# EAGLE schematic Omniband (EAGLE 9.6.2)
COMPANY: ADAFRUIT INDUSTRIES; DRAWN: KTOWN; REV: F
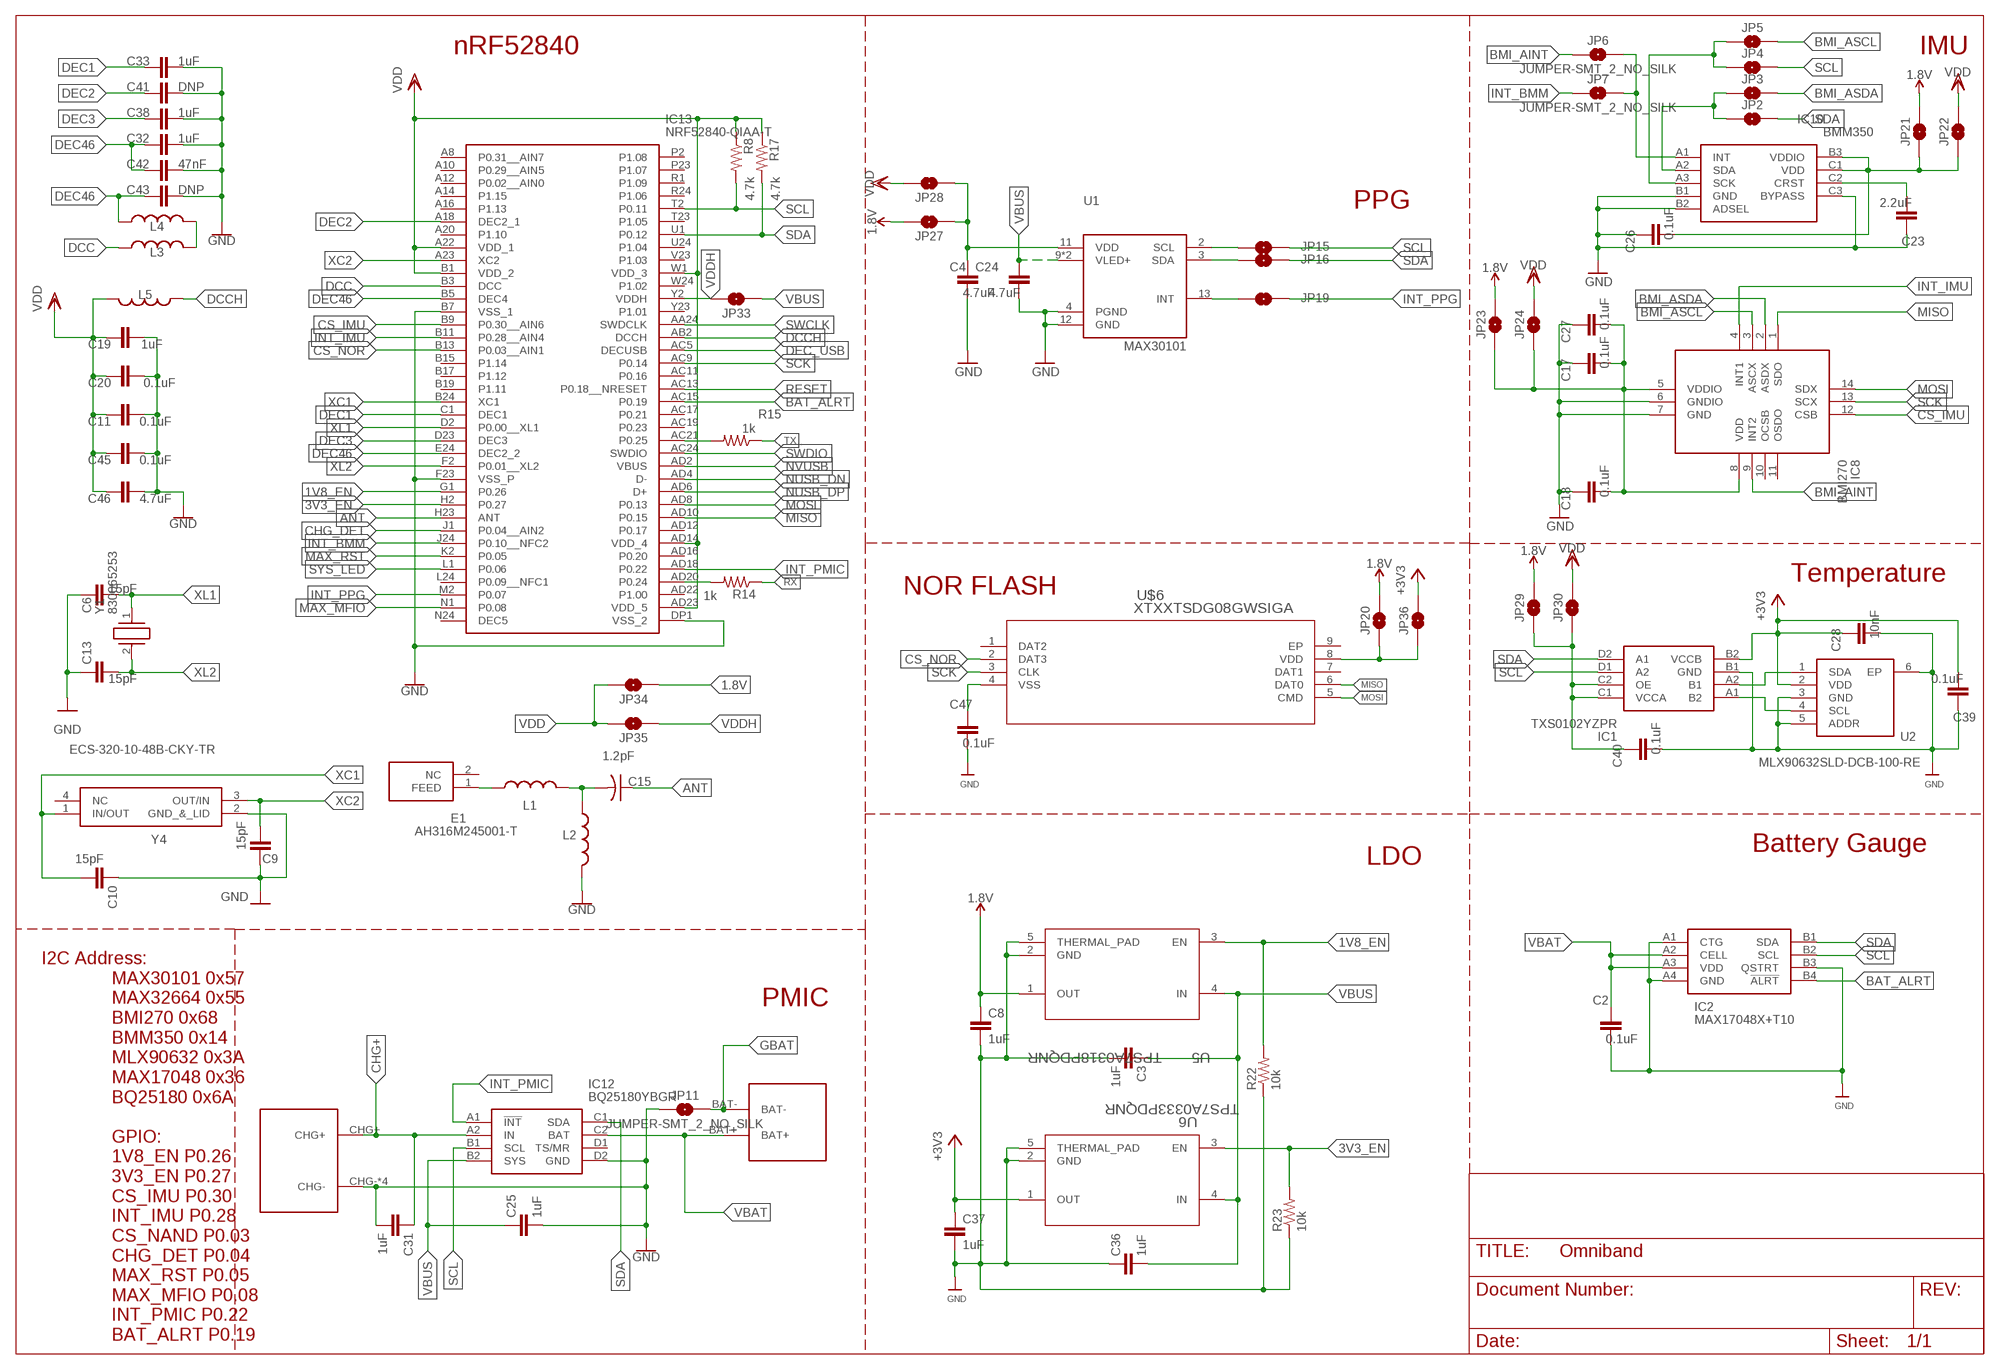
[diagram p0: schematic, sheet 1, part 1 of 2]
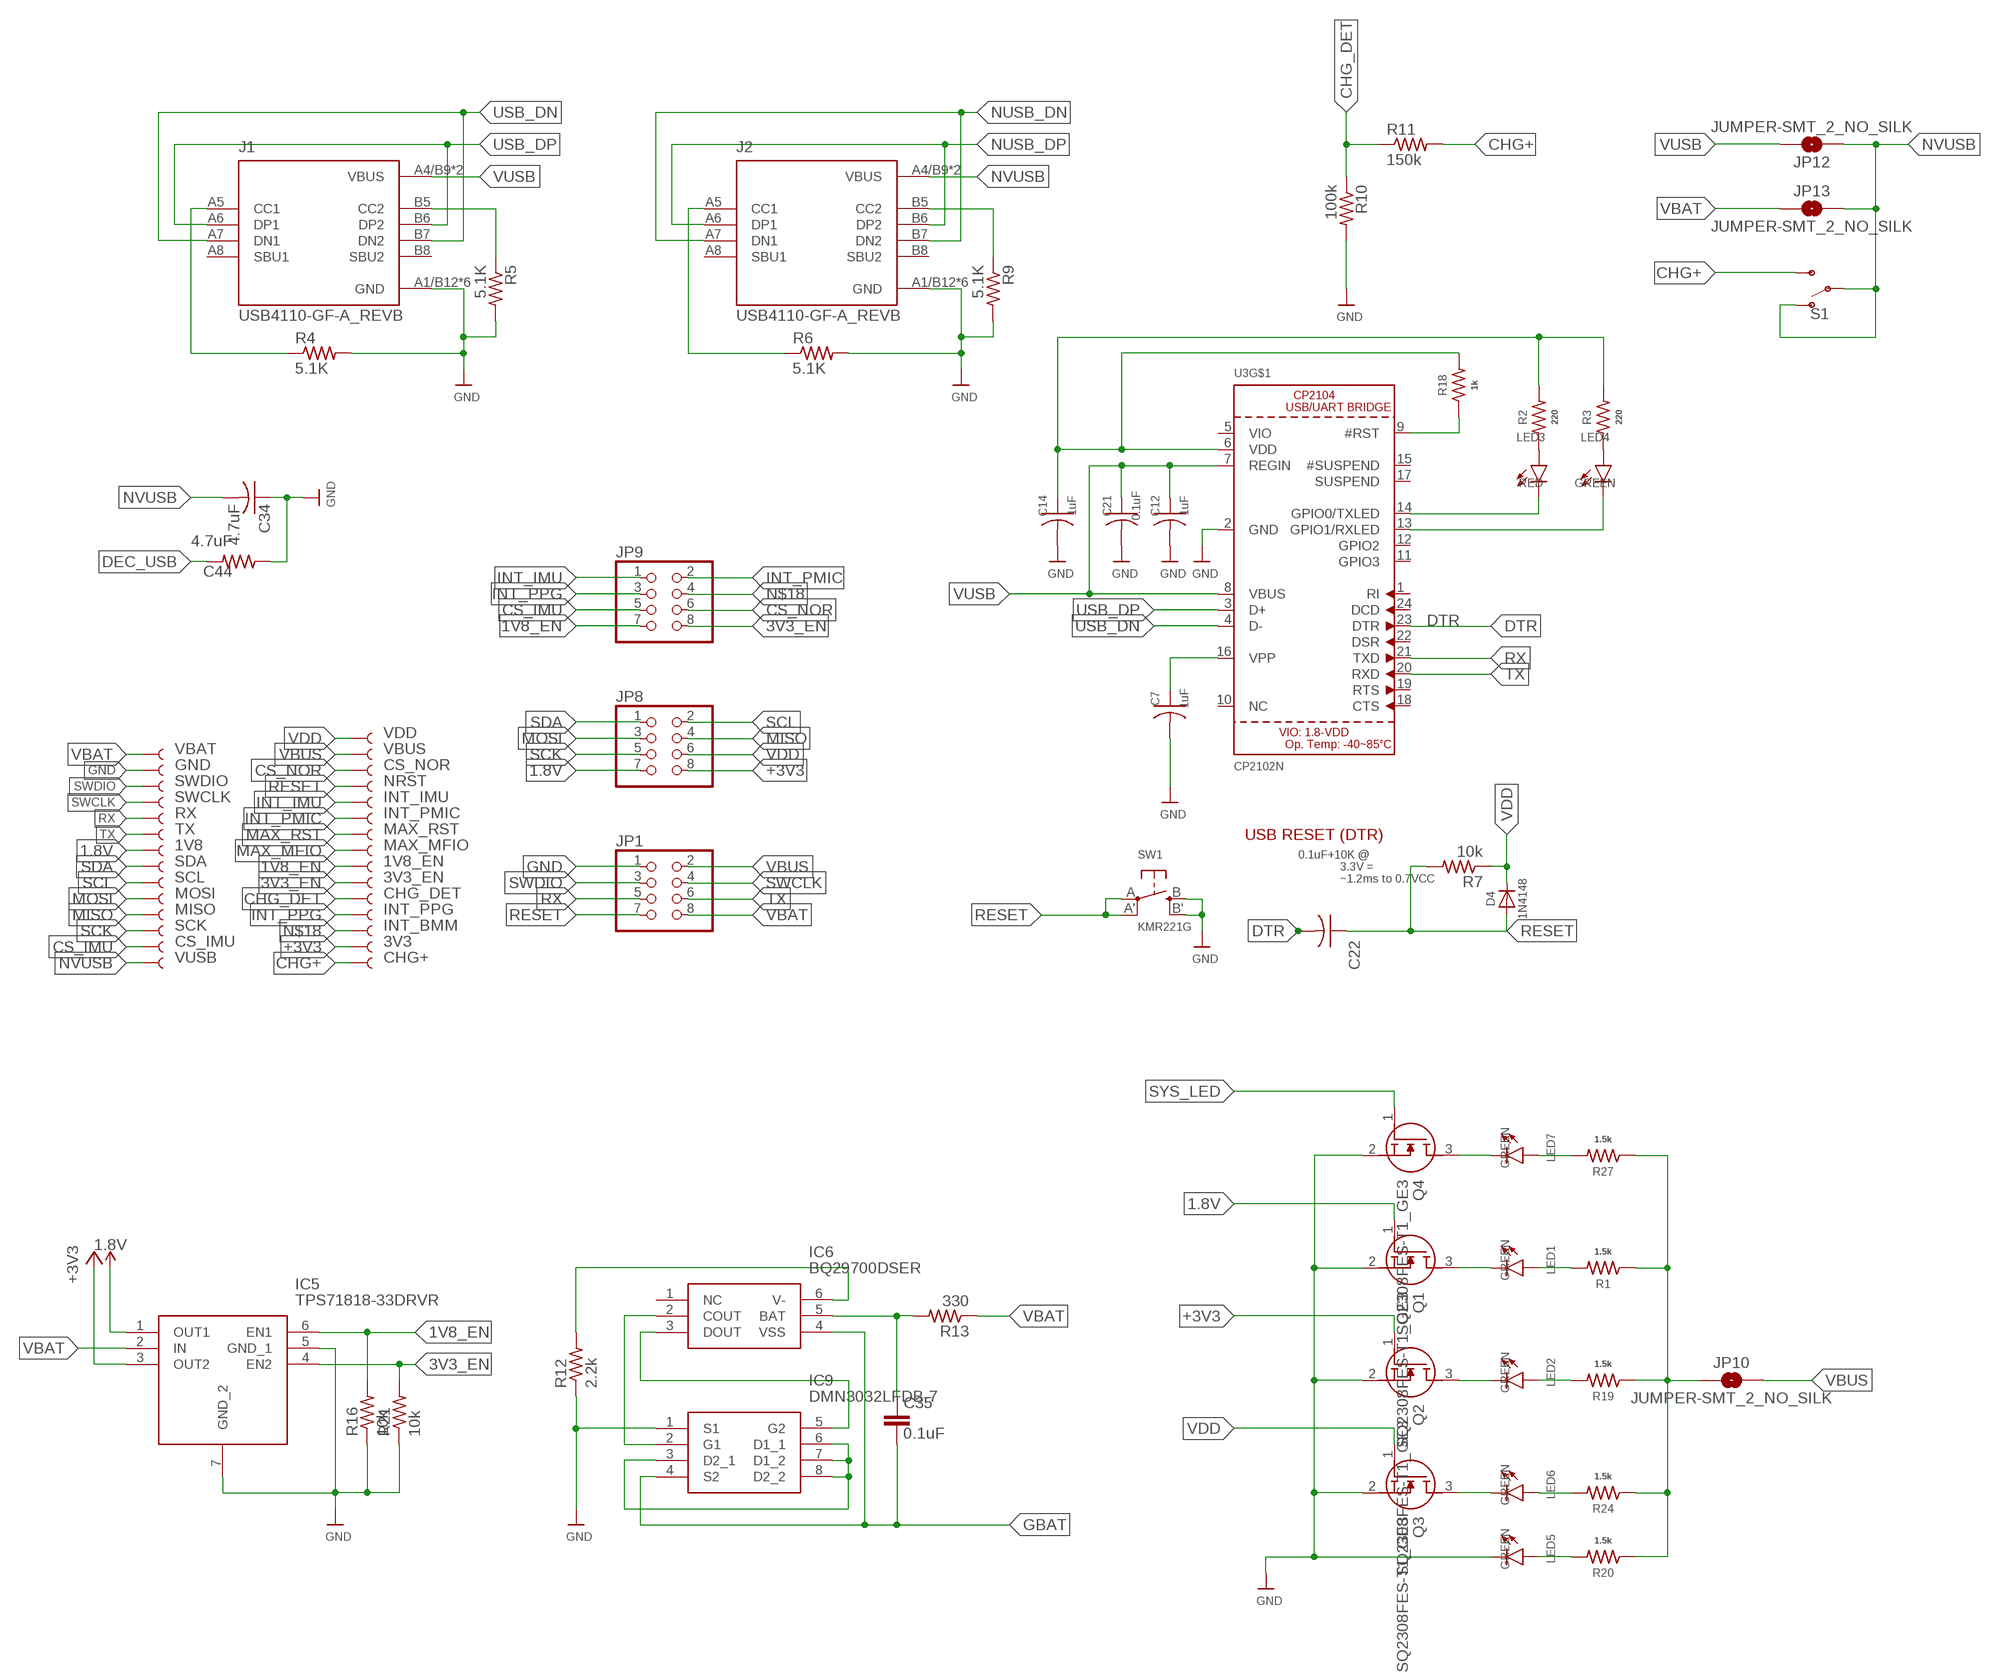
[diagram p1: schematic, sheet 1, part 2 of 2]

## Parts
1V8  TEST-POINT3  [PAD.03X.03]
1V8_EN  TEST-POINT3  [PAD.03X.03]
3V3  TEST-POINT3  [PAD.03X.03]
3V3_EN  TEST-POINT3  [PAD.03X.03]
C2  0.1uF  C-EUC0201  [C0201]
C3  1uF  C-EUC0201  [C0201]
C4  4.7uF  C-EUC0201  [C0201]
C6  15pF  C-EUC0201  [C0201]
C7  1uF  C-USC0603  [C0603]
C8  1uF  C-EUC0201  [C0201]
C9  15pF  C-EUC0201  [C0201]
C10  15pF  C-EUC0201  [C0201]
C11  0.1uF  C-EUC0201  [C0201]
C12  1uF  C-USC0603  [C0603]
C13  15pF  C-EUC0201  [C0201]
C14  1uF  C-USC0603  [C0603]
C15  1.2pF  C-USC0201  [C0201]
C17  0.1uF  C-EUC0201  [C0201]
C18  0.1uF  C-EUC0201  [C0201]
C19  1uF  C-EUC0201  [C0201]
C20  0.1uF  C-EUC0201  [C0201]
C21  0.1uF  C-USC0603  [C0603]
C22  220nF  C-USC0603  [C0603]
C23  2.2uF  C-EUC0201  [C0201]
C24  4.7uF  C-EUC0201  [C0201]
C25  1uF  C-EUC0201  [C0201]
C26  0.1uF  C-EUC0201  [C0201]
C27  0.1uF  C-EUC0201  [C0201]
C28  10nF  C-EUC0201  [C0201]
C31  1uF  C-EUC0201  [C0201]
C32  1uF  C-EUC0201  [C0201]
C33  1uF  C-EUC0201  [C0201]
C34  4.7uF  C-USC0603  [C0603]
C35  0.1uF  C-EUC0201  [C0201]
C36  1uF  C-EUC0201  [C0201]
C37  1uF  C-EUC0201  [C0201]
C38  1uF  C-EUC0201  [C0201]
C39  0.1uF  C-EUC0201  [C0201]
C40  0.1uF  C-EUC0201  [C0201]
C41  DNP  C-EUC0201  [C0201]
C42  47nF  C-EUC0201  [C0201]
C43  DNP  C-EUC0201  [C0201]
C44  4.7uF  R-US_R0201  [R0201]
C45  0.1uF  C-EUC0201  [C0201]
C46  4.7uF  C-EUC0201  [C0201]
C47  0.1uF  C-EUC0201  [C0201]
CHG+  TEST-POINT3  [PAD.03X.03]
CHG_DET  TEST-POINT3  [PAD.03X.03]
CS_IMU  TEST-POINT3  [PAD.03X.03]
CS_NOR  TEST-POINT3  [PAD.03X.03]
D4  1N4148  DIODESOD-323  [SOD-323]
E1  AH316M245001-T  [ANTC3216X60N]
GND  TEST-POINT3  [PAD.03X.03]
IC1  TXS0102YZPR  [BGA8C50P2X4_89X189X50]
IC2  MAX17048X+T10  [BGA8C40P4X2_167X93X69]
IC5  TPS71818-33DRVR  [SON65P200X200X80-7N]
IC6  BQ29700DSER  [SON50P150X150X80-6N]
IC8  BMI270  [BMI270]
IC9  DMN3032LFDB-7  [DMP1046UFDB7]
IC10  BMM350  [BGA9C40P3X3_128X128X54]
IC12  BQ25180YBGR  [BGA8C40P2X4_100X155X50]
IC13  NRF52840-QIAA-T  [NRF52840QIAAT]
INT_BMM  TEST-POINT3  [PAD.03X.03]
INT_IMU  TEST-POINT3  [PAD.03X.03]
INT_PMIC  TEST-POINT3  [PAD.03X.03]
INT_PPG  TEST-POINT3  [PAD.03X.03]
J1  USB4110-GF-A_REVB  [GCT_USB4110-GF-A_REVB]
J2  USB4110-GF-A_REVB  [GCT_USB4110-GF-A_REVB]
JP1  PINHD-2X4  [2X04]
JP2  JUMPER-SMT_2_NO_SILK  [SMT-JUMPER_2_NO_SILK]
JP3  JUMPER-SMT_2_NO_SILK  [SMT-JUMPER_2_NO_SILK]
JP4  JUMPER-SMT_2_NO_SILK  [SMT-JUMPER_2_NO_SILK]
JP5  JUMPER-SMT_2_NO_SILK  [SMT-JUMPER_2_NO_SILK]
JP6  JUMPER-SMT_2_NO_SILK  [SMT-JUMPER_2_NO_SILK]
JP7  JUMPER-SMT_2_NO_SILK  [SMT-JUMPER_2_NO_SILK]
JP8  PINHD-2X4  [2X04]
JP9  PINHD-2X4  [2X04]
JP10  JUMPER-SMT_2_NO_SILK  [SMT-JUMPER_2_NO_SILK]
JP11  JUMPER-SMT_2_NO_SILK  [SMT-JUMPER_2_NO_SILK]
JP12  JUMPER-SMT_2_NO_SILK  [SMT-JUMPER_2_NO_SILK]
JP13  JUMPER-SMT_2_NO_SILK  [SMT-JUMPER_2_NO_SILK]
JP15  JUMPER-SMT_2_NO_SILK  [SMT-JUMPER_2_NO_SILK]
JP16  JUMPER-SMT_2_NO_SILK  [SMT-JUMPER_2_NO_SILK]
JP19  JUMPER-SMT_2_NO_SILK  [SMT-JUMPER_2_NO_SILK]
JP20  JUMPER-SMT_2_NO_SILK  [SMT-JUMPER_2_NO_SILK]
JP21  JUMPER-SMT_2_NO_SILK  [SMT-JUMPER_2_NO_SILK]
JP22  JUMPER-SMT_2_NO_SILK  [SMT-JUMPER_2_NO_SILK]
JP23  JUMPER-SMT_2_NO_SILK  [SMT-JUMPER_2_NO_SILK]
JP24  JUMPER-SMT_2_NO_SILK  [SMT-JUMPER_2_NO_SILK]
JP27  JUMPER-SMT_2_NO_SILK  [SMT-JUMPER_2_NO_SILK]
JP28  JUMPER-SMT_2_NO_SILK  [SMT-JUMPER_2_NO_SILK]
JP29  JUMPER-SMT_2_NO_SILK  [SMT-JUMPER_2_NO_SILK]
JP30  JUMPER-SMT_2_NO_SILK  [SMT-JUMPER_2_NO_SILK]
JP33  JUMPER-SMT_2_NO_SILK  [SMT-JUMPER_2_NO_SILK]
JP34  JUMPER-SMT_2_NO_SILK  [SMT-JUMPER_2_NO_SILK]
JP35  JUMPER-SMT_2_NO_SILK  [SMT-JUMPER_2_NO_SILK]
JP36  JUMPER-SMT_2_NO_SILK  [SMT-JUMPER_2_NO_SILK]
L1  3.3nH  L-USL0201  [L0201]
L2  2.7nH  L-USL0201  [L0201]
L3  10uH  L-USL0201  [L0201]
L4  15nH  L-USL0201  [L0201]
L5  2.7nH  L-USL0201  [L0201]
LED1  GREEN  LEDCHIPLED_0603  [CHIPLED_0603]
LED2  GREEN  LEDCHIPLED_0603  [CHIPLED_0603]
LED3  RED  LEDCHIPLED_0603  [CHIPLED_0603]
LED4  GREEN  LEDCHIPLED_0603  [CHIPLED_0603]
LED5  GREEN  LEDCHIPLED_0603  [CHIPLED_0603]
LED6  GREEN  LEDCHIPLED_0603  [CHIPLED_0603]
LED7  GREEN  LEDCHIPLED_0603  [CHIPLED_0603]
MAX_MFIO  TEST-POINT3  [PAD.03X.03]
MAX_RST  TEST-POINT3  [PAD.03X.03]
MISO  TEST-POINT3  [PAD.03X.03]
MOSI  TEST-POINT3  [PAD.03X.03]
NRST  TEST-POINT3  [PAD.03X.03]
Q1  SQ2308FES-T1_GE3  [SOT95P237X112-3N]
Q2  SQ2308FES-T1_GE3  [SOT95P237X112-3N]
Q3  SQ2308FES-T1_GE3  [SOT95P237X112-3N]
Q4  SQ2308FES-T1_GE3  [SOT95P237X112-3N]
R1  1.5k  R-US_R0603  [R0603]
R2  220  R-US_R0603  [R0603]
R3  220  R-US_R0603  [R0603]
R4  5.1K  R-US_R0603  [R0603]
R5  5.1K  R-US_R0603  [R0603]
R6  5.1K  R-US_R0603  [R0603]
R7  10k  R-US_R0603  [R0603]
R8  4.7k  R-US_R0201  [R0201]
R9  5.1K  R-US_R0603  [R0603]
R10  100k  R-US_R0603  [R0603]
R11  150k  R-US_R0603  [R0603]
R12  2.2k  R-US_R0201  [R0201]
R13  330  R-US_R0201  [R0201]
R14  1k  R-US_R0201  [R0201]
R15  1k  R-US_R0201  [R0201]
R16  10k  R-US_R0201  [R0201]
R17  4.7k  R-US_R0201  [R0201]
R18  1k  R-US_R0603  [R0603]
R19  1.5k  R-US_R0603  [R0603]
R20  1.5k  R-US_R0603  [R0603]
R21  10k  R-US_R0201  [R0201]
R22  10k  R-US_R0201  [R0201]
R23  10k  R-US_R0201  [R0201]
R24  1.5k  R-US_R0603  [R0603]
R27  1.5k  R-US_R0603  [R0603]
RX  TEST-POINT3  [PAD.03X.03]
S1  SWITCH-SPDT-SMD-RIGHT-ANGLE  [SWITCH_SPST_SMD_A]
SCK  TEST-POINT3  [PAD.03X.03]
SCL  TEST-POINT3  [PAD.03X.03]
SDA  TEST-POINT3  [PAD.03X.03]
SW1  KMR221G  SWITCH_TACT_SMT4.6X2.8  [BTN_KMR2_4.6X2.8]
SWCLK  TEST-POINT3  [PAD.03X.03]
SWDIO  TEST-POINT3  [PAD.03X.03]
TX  TEST-POINT3  [PAD.03X.03]
U1  MAX30101  AS-ITM-00473  [MAX30100]
U2  MLX90632SLD-DCB-100-RE  [MLX90632SLDDCB100RE]
U3  CP2102N  CP2104  [QFN24_4MM_SMSC]
U5  TPS7A0318PDQNR  [DQN0004A-MFG]
U6  TPS7A0333PDQNR  [DQN0004A-MFG]
U$3  GRP160722  [GRP160722]
U$6  XTXXTSDG08GWSIGA  [WNG008_SPA]
U$8  CX-4MM-JZ  [CX-4MM-JZ]
VBAT  TEST-POINT3  [PAD.03X.03]
VBUS  TEST-POINT3  [PAD.03X.03]
VDD  TEST-POINT3  [PAD.03X.03]
VUSB  TEST-POINT3  [PAD.03X.03]
Y1  830065253  [830065253]
Y4  ECS-320-10-48B-CKY-TR  [ECS3201048BCKYTR]

## Nets
1.8V [POWER]: 1V8.P$1 C8.1 IC5.1(OUT1) JP8.7 JP20.2 JP21.2 JP23.2 JP27.2 JP29.2 JP34.1 Q1.1(G) U5.1(OUT)
1V8_EN: 1V8_EN.P$1 IC5.6(EN1) IC13.G1(P0.26) JP9.7 R16.2 R22.2 U5.3(EN)
3V3_EN: 3V3_EN.P$1 IC5.4(EN2) IC13.H2(P0.27) JP9.8 R21.2 R23.2 U6.3(EN)
+3V3: 3V3.P$1 C28.1 C37.1 C39.2 IC1.B2(VCCB) IC5.3(OUT2) JP8.8 JP36.2 Q2.1(G) U2.2(VDD) U6.1(OUT)
ANT: C15.1 IC13.H23(ANT)
BAT_ALRT: IC2.B4(!ALRT) IC13.AC15(P0.19)
BMI_AINT: IC8.9(INT2) JP6.1
BMI_ASCL: IC8.3(ASCX) JP5.2
BMI_ASDA: IC8.2(ASDX) JP3.2
CHG+: C31.1 CHG+.P$1 IC12.A2(IN) R11.2 S1.3(S) U$8.CHG+
CHG_DET: CHG_DET.P$1 IC13.J1(P0.04__AIN2) R10.1 R11.1
CS_IMU: CS_IMU.P$1 IC8.12(CSB) IC13.B9(P0.30__AIN6) JP9.5
CS_NOR: CS_NOR.P$1 IC13.B13(P0.03__AIN1) JP9.6 U$6.2(DAT3)
DCC: IC13.B3(DCC) L3.1
DCCH: IC13.AB2(DCCH) L5.1
DEC1: C33.2 IC13.C1(DEC1)
DEC2: C41.2 IC13.A18(DEC2_1)
DEC3: C38.2 IC13.D23(DEC3)
DEC46: C32.2 C42.2 C43.2 IC13.B5(DEC4) IC13.E24(DEC2_2) L4.1
DEC_USB: C44.2 IC13.AC5(DECUSB)
DTR: C22.2 U3.23(DTR)
GBAT: C35.2 IC6.4(VSS) IC9.4(S2) JP11.2 U$3.BAT-
GND: C2.2 C3.2 C4.2 C6.1 C7.2 C8.2 C9.1 C10.1 C11.1 C12.2 C13.1 C14.2 C17.1 C18.1 C19.2 C20.2 C21.2 C23.1 C24.2 C25.2 C26.1 C27.1 C28.2 C31.2 C32.1 C33.1 C34.1 C36.1 C37.2 C38.1 C39.1 C40.2 C41.1 C42.1 C43.1 C44.1 C45.1 C46.1 C47.2 GND.P$1 IC1.B1(GND) IC2.A1(CTG) IC2.A4(GND) IC2.B3(QSTRT) IC5.5(GND_1) IC5.7(GND_2) IC8.6(GNDIO) IC8.7(GND) IC9.1(S1) IC10.B1(GND) IC10.B2(ADSEL) IC10.C3(BYPASS) IC12.D2(GND) IC13.B7(VSS_1) IC13.DP1(VSS_2) IC13.F23(VSS_P) J1.A1/B12(GND) J1.B1/A12(GND) J1.S1(GND) J1.S2(GND) J1.S3(GND) J1.S4(GND) J2.A1/B12(GND) J2.B1/A12(GND) J2.S1(GND) J2.S2(GND) J2.S3(GND) J2.S4(GND) JP1.1 JP11.1 L2.2 LED5.C Q1.2(S) Q2.2(S) Q3.2(S) Q4.2(S) R4.2 R5.2 R6.2 R9.2 R10.2 R12.1 R16.1 R21.1 R22.1 R23.1 SW1.B'(S1) SW1.B(S) U1.4(PGND) U1.12(GND) U2.3(GND) U2.5(ADDR) U2.6(EP) U3.2(GND) U5.2(GND) U5.5(THERMAL_PAD) U6.2(GND) U6.5(THERMAL_PAD) U$8.CHG- U$8.CHG-1(CHG-) U$8.CHG-2(CHG-) U$8.CHG-3(CHG-) Y4.2(GND_&_LID)
INT_BMM: IC13.J24(P0.10__NFC2) JP7.1
INT_IMU: IC8.4(INT1) IC13.B11(P0.28__AIN4) INT_IMU.P$1 JP9.1
INT_PMIC: IC12.A1(!INT) IC13.AD18(P0.22) INT_PMIC.P$1 JP9.2
INT_PPG: IC13.M2(P0.07) INT_PPG.P$1 JP9.3 JP19.2
MAX_MFIO: IC13.N1(P0.08) MAX_MFIO.P$1
MAX_RST: IC13.K2(P0.05) MAX_RST.P$1
MISO: IC8.1(SDO) IC13.AD10(P0.15) JP8.4 MISO.P$1 U$6.6(DAT0)
MOSI: IC8.14(SDX) IC13.AD8(P0.13) JP8.3 MOSI.P$1 U$6.5(CMD)
N$1: L3.2 L4.2
N$2: C47.1 U$6.4(VSS)
N$3: JP15.1 U1.2(SCL)
N$4: C15.2 L1.2 L2.1
N$5: IC10.A2(SDA) JP2.1 JP3.1
N$8: E1.1(FEED) L1.1
N$9: IC10.A3(SCK) JP4.1 JP5.1
N$10: IC6.2(COUT) IC9.2(G1)
N$11: J1.B5(CC2) R5.1
N$12: IC13.AC21(P0.25) R15.2
N$13: IC13.AD20(P0.24) R14.2
N$14: C23.2 IC10.C2(CRST)
N$15: C7.1 U3.16(VPP)
N$17: JP10.1 R1.1 R19.1 R20.1 R24.1 R27.1
N$18: IC10.A1(INT) INT_BMM.P$1 JP6.2 JP7.2 JP9.4
N$19: LED6.C Q3.3(D)
N$21: LED3.A R2.1
N$22: LED4.A R3.1
N$23: LED3.C U3.14(GPIO0/TXLED)
N$24: LED4.C U3.13(GPIO1/RXLED)
N$25: J1.A5(CC1) R4.1
N$26: J2.B5(CC2) R9.1
N$27: J2.A5(CC1) R6.1
N$28: IC6.3(DOUT) IC9.5(G2)
N$29: IC9.3(D2_1) IC9.6(D1_1) IC9.7(D1_2) IC9.8(D2_2)
N$30: R18.1 U3.9(#RST)
N$31: IC6.6(V-) R12.2
N$32: C35.1 IC6.5(BAT) R13.2
N$33: LED2.A R19.2
N$34: LED6.A R24.2
N$35 [POWER]: C40.1 IC1.C1(VCCA) IC1.C2(OE) JP29.1 JP30.1
N$36: IC1.A2(B1) U2.1(SDA)
N$37: IC1.A1(B2) U2.4(SCL)
N$38: C14.1 R2.2 R3.2 R18.2 U3.6(VDD)
N$39: LED5.A R20.2
N$40: LED1.A R1.2
N$41: LED1.C Q1.3(D)
N$42: LED2.C Q2.3(D)
N$43: JP16.1 U1.3(SDA)
N$44: JP19.1 U1.13(INT)
N$48 [POWER]: C17.2 C18.2 C27.2 IC8.5(VDDIO) IC8.8(VDD) JP23.1 JP24.1
N$50 [POWER]: C26.2 IC10.B3(VDDIO) IC10.C1(VDD) JP21.1 JP22.1
N$51 [POWER]: C4.1 JP27.1 JP28.1 U1.11(VDD)
N$53: JP20.1 JP36.1 U$6.8(VDD)
N$54: LED7.C Q4.3(D)
N$55: LED7.A R27.2
NUSB_DN: IC13.AD4(D-) J2.A7(DN1) J2.B7(DN2)
NUSB_DP: IC13.AD6(D+) J2.A6(DP1) J2.B6(DP2)
NVUSB: C34.2 IC13.AD2(VBUS) J2.A4/B9(VBUS) J2.B4/A9(VBUS) JP12.1 JP13.2 S1.1(O) S1.2(P) VUSB.P$1
RESET: C22.1 D4.A IC13.AC13(P0.18__NRESET) JP1.7 NRST.P$1 R7.2 SW1.A'(P1) SW1.A(P)
RX: JP1.5 R14.1 RX.P$1 U3.21(TXD)
SCK: IC8.13(SCX) IC13.AC9(P0.14) JP8.5 SCK.P$1 U$6.3(CLK)
SCL: IC1.D1(A2) IC2.B2(SCL) IC12.B1(SCL) IC13.T2(P0.11) JP4.2 JP8.2 JP15.2 R8.2 SCL.P$1
SDA: IC1.D2(A1) IC2.B1(SDA) IC12.C1(SDA) IC13.U1(P0.12) JP2.2 JP8.1 JP16.2 R17.2 SDA.P$1
SWCLK: IC13.AA24(SWDCLK) JP1.4 SWCLK.P$1
SWDIO: IC13.AC24(SWDIO) JP1.3 SWDIO.P$1
SYS_LED: IC13.L1(P0.06) Q4.1(G)
TX: JP1.6 R15.1 TX.P$1 U3.20(RXD)
USB_DN: J1.A7(DN1) J1.B7(DN2) U3.4(D-)
USB_DP: J1.A6(DP1) J1.B6(DP2) U3.3(D+)
VBAT [POWER]: C2.1 IC2.A2(CELL) IC2.A3(VDD) IC5.2(IN) IC12.C2(BAT) JP1.8 JP13.1 R13.1 U$3.BAT+ VBAT.P$1
VBUS [POWER]: C3.1 C24.1 C25.1 C36.2 IC12.B2(SYS) JP1.2 JP10.2 JP33.1 U1.9(VLED+) U1.10(VLED+) U5.4(IN) U6.4(IN) VBUS.P$1
VDD [POWER]: C11.2 C19.1 C20.1 C45.2 C46.2 D4.C IC13.A22(VDD_1) IC13.AD14(VDD_4) IC13.AD23(VDD_5) IC13.B1(VDD_2) IC13.W1(VDD_3) JP8.6 JP22.2 JP24.2 JP28.2 JP30.2 JP34.2 JP35.2 L5.2 Q3.1(G) R7.1 R8.1 R17.1 VDD.P$1
VDDH: IC13.Y2(VDDH) JP33.2 JP35.1
VUSB: C12.1 C21.1 J1.A4/B9(VBUS) J1.B4/A9(VBUS) JP12.2 U3.7(REGIN) U3.8(VBUS)
XC1: C10.2 IC13.B24(XC1) Y4.1(IN/OUT)
XC2: C9.2 IC13.A23(XC2) Y4.3(OUT/IN)
XL1: C6.2 IC13.D2(P0.00__XL1) Y1.1(CRYSTAL_1)
XL2: C13.2 IC13.F2(P0.01__XL2) Y1.2(CRYSTAL_2)
Unconnected: E1.2(NC) IC6.1(NC) IC8.10(OCSB) IC8.11(OSDO) IC12.D1(TS/MR) IC13.A8(P0.31__AIN7) IC13.A10(P0.29__AIN5) IC13.A12(P0.02__AIN0) IC13.A14(P1.15) IC13.A16(P1.13) IC13.A20(P1.10) IC13.AC11(P0.16) IC13.AC17(P0.21) IC13.AC19(P0.23) IC13.AD12(P0.17) IC13.AD16(P0.20) IC13.AD22(P1.00) IC13.B15(P1.14) IC13.B17(P1.12) IC13.B19(P1.11) IC13.L24(P0.09__NFC1) IC13.N24(DEC5) IC13.P2(P1.08) IC13.P23(P1.07) IC13.R1(P1.09) IC13.R24(P1.06) IC13.T23(P1.05) IC13.U24(P1.04) IC13.V23(P1.03) IC13.W24(P1.02) IC13.Y23(P1.01) J1.A8(SBU1) J1.B8(SBU2) J2.A8(SBU1) J2.B8(SBU2) U3.1(RI) U3.10(NC) U3.11(GPIO3) U3.12(GPIO2) U3.15(#SUSPEND) U3.17(SUSPEND) U3.18(CTS) U3.19(RTS) U3.22(DSR) U3.24(DCD) U$6.1(DAT2) U$6.7(DAT1) U$6.9(EP) Y4.4(NC)

## Notes on the sheet
- nRF52840 | IMU
- PPG
- Temperature
- NOR FLASH
- USB RESET (DTR)
- 0.1uF+10K @
                3.3V =
                ~1.2ms to 0.7VCC
- Battery Gauge
- LDO
- PMIC
- I2C Address:
                MAX30101 0x57
                MAX32664 0x55
                BMI270 0x68
                BMM350 0x14
                MLX90632 0x3A
                MAX17048 0x36
                BQ25180 0x6A
  
                GPIO:
                1V8_EN P0.26
                3V3_EN P0.27
                CS_IMU P0.30
                INT_IMU P0.28
                CS_NAND P0.03
                CHG_DET P0.04
                MAX_RST P0.05
                MAX_MFIO P0.08
                INT_PMIC P0.22
                BAT_ALRT P0.19

## Power pins joined to a net without a drawn wire
TP: U3.THERM(TP)
VIO: U3.5(VIO)

## Library data of the parts
1V8 1V8_EN 3V3 3V3_EN CHG+ CHG_DET CS_IMU CS_NOR GND INT_BMM INT_IMU INT_PMIC INT_PPG MAX_MFIO MAX_RST MISO MOSI NRST RX SCK SCL SDA SWCLK SWDIO TX VBAT VBUS VDD VUSB = SparkFun-Connectors:TEST-POINT: SparkFun Test Points Bare copper test points for troubleshooting or In-Circuit-Testing. These are used by our Production team for verifying production board runs using pogo-pins on test beds. SparkFun Products: SparkFun LSM9DS1 Breakout <https://www.sparkfun.com/products/13284> SparkFun PSOC <https://www.sparkfun.com/products/13714> SparkFun Load Cell Amplifier <https://www.sparkfun.com/products/13879>
C2-C4 C6 C8-C11 C13 C17-C20 C23-C28 C31-C33 C35-C43 C45-C47 = rcl:C-EU: CAPACITOR, European symbol; SPICEPREFIX: C
C7 C12 C14 C15 C21 C22 C34 = rcl:C-US: CAPACITOR, American symbol; SPICEPREFIX: C
C44 R1-R24 R27 = rcl:R-US_: RESISTOR, American symbol; SPICEPREFIX: R
D4 = microbuilder:DIODE: Diode SMA Model Volts Amps Type Vf Ir Digikey # Notes SSA34-E3 40V 3A Schottky 480mV @ 3A 200uA @ 40V SSA34-E3/61TGITR-ND CDBA120-G 20V 1A Schottky 500mV @ 1A 500uA @ 20V 641-1014-6-ND REEL MBRA210 10V 2A Schottky 350mV @ 2A 700uA @ 10V MBRA210LT3 SOD-123 Model Volts Amps Type Vf Ir Order # Notes BAT54T1G 30V 200mA Schottky 800mV @ 200mA 2uA @ 25V BAT54T1GOSTR-ND B0530W 30V 500mA Schottky 430mV @ 500mA 130uA @ 30V B0530W-FDICT-ND REEL MBR120 20V 1A Schottky 340mV @ 1A MBR120VLSFT1GOSCT-ND SOD-323 Model Volts Amps Type Vf Ir Order # Notes PMEG2005EJ 20V 500mA Schottky 355mV @ 500mA 568-4110-1-ND ZLLS410 10V 570mA Schottky 380mV @ 570mA ZLLS410CT-ND 1N4148WS 75V 150mA Silicon/Simple 1V 1N4148WSFSCT-ND REEL SOD-523 Model Volts Amps Type Vf Ir Order # Notes BAT54XV2 30V 200mA Schottky 0.8V @ 100mA BAT54XV2CT-ND TB751S 30V 30mA Schottky RB751S-40TE61CT-ND SOT23-R/W (R = Solder Paste/Reflow Ovens, W = Hand-Soldering) Model Volts Amps Type Vf Ir Order # Notes BAT54FILM 40V 300mA Schottky 497-7162-1-ND POWERDI-5 Model Volts Amps Type Vf Ir Order # Notes PDS560 60V 5A Schottky 670mV @ 5A 150uA @ 60V PDS560DICT-ND
E1 = SamacSys_Parts:AH316M245001-T: Antennas SURF MOUNT ANTENNA RADIEDGE Source: Datasheet; DESCRIPTION: Antennas SURF MOUNT ANTENNA RADIEDGE; HEIGHT: 0.6mm; MANUFACTURER_NAME: TAIYO YUDEN; MANUFACTURER_PART_NUMBER: AH316M245001-T; MOUSER_PART_NUMBER: 963-AH316M245001-T; MOUSER_PRICE-STOCK: https://www.mouser.co.uk/ProductDetail/TAIYO-YUDEN/AH316M245001-T?qs=I6KAKw0tg2zXv3bNBw9dFQ%3D%3D
IC1 = TXS0102YZPR:TXS0102YZPR: 2-Bit Bidirectional Voltage-Level Shifter for Open-Drain and Push-Pull Application Source: Datasheet <http://componentsearchengine.com/Datasheets/3/TXS0102YZPR.pdf>; DESCRIPTION: 2-Bit Bidirectional Voltage-Level Shifter for Open-Drain and Push-Pull Application; HEIGHT: 0.5mm; MANUFACTURER_NAME: Texas Instruments; MANUFACTURER_PART_NUMBER: TXS0102YZPR; MOUSER_PART_NUMBER: 595-TXS0102YZPR; MOUSER_PRICE-STOCK: https://www.mouser.co.uk/ProductDetail/Texas-Instruments/TXS0102YZPR?qs=0OHPnBYoB%2FnEzbbqlIZg1Q%3D%3D
IC2 = SamacSys_Parts:MAX17048X+T10: Battery Battery Monitor IC Lithium Ion 8-WLP (1.66x0.92) Source: Datasheet <https://pdfserv.maximintegrated.com/package_dwgs/21-0555.PDF>; DESCRIPTION: Battery Battery Monitor IC Lithium Ion 8-WLP (1.66x0.92); HEIGHT: 0.69mm; MANUFACTURER_NAME: Analog Devices; MANUFACTURER_PART_NUMBER: MAX17048X+T10; MOUSER_PART_NUMBER: 700-MAX17048X+T10; MOUSER_PRICE-STOCK: https://www.mouser.co.uk/ProductDetail/Analog-Devices-Maxim-Integrated/MAX17048X%2bT10?qs=skSDD0nPMtl2jmkDAM2OXw%3D%3D
IC5 = SamacSys_Parts:TPS71818-33DRVR: Dual 200mA Output, Low Noise, High PSRR, Low Dropout, Linear Regulator Source: Datasheet <http://www.ti.com/lit/gpn/TPS718>; ARROW_PART_NUMBER: TPS71818-33DRVR; ARROW_PRICE-STOCK: https://www.arrow.com/en/products/tps71818-33drvr/texas-instruments; DESCRIPTION: Dual 200mA Output, Low Noise, High PSRR, Low Dropout, Linear Regulator; HEIGHT: 0.8mm; MANUFACTURER_NAME: Texas Instruments; MANUFACTURER_PART_NUMBER: TPS71818-33DRVR
IC6 = SamacSys_Parts:BQ29700DSER: Li-Ion/Li Polymer Advanced Single-Cell Battery Protector IC Family Source: Datasheet <http://www.ti.com/lit/ds/symlink/bq2971.pdf>; DESCRIPTION: Li-Ion/Li Polymer Advanced Single-Cell Battery Protector IC Family; HEIGHT: 0.8mm; MANUFACTURER_NAME: Texas Instruments; MANUFACTURER_PART_NUMBER: BQ29700DSER; MOUSER_PART_NUMBER: 595-BQ29700DSER; MOUSER_PRICE-STOCK: https://www.mouser.co.uk/ProductDetail/Texas-Instruments/BQ29700DSER?qs=%2Fd%252BFzHvH4c3zNh7Hkm%2Fvbw%3D%3D
IC8 = SamacSys_Parts:BMI270: IMUs - Inertial Measurement Units Smart Ultra-Low Power Inertial Measurement Unit (IMU) for Wearable Applications Source: Datasheet <https://www.bosch-sensortec.com/media/boschsensortec/downloads/datasheets/bst-bmi270-ds000.pdf>; DESCRIPTION: IMUs - Inertial Measurement Units Smart Ultra-Low Power Inertial Measurement Unit (IMU) for Wearable Applications; HEIGHT: 0.87mm; MANUFACTURER_NAME: BOSCH; MANUFACTURER_PART_NUMBER: BMI270; MOUSER_PART_NUMBER: 262-BMI270; MOUSER_PRICE-STOCK: https://www.mouser.co.uk/ProductDetail/Bosch-Sensortec/BMI270?qs=u16ybLDytRYIj%252BjQEee88A%3D%3D
IC9 = SamacSys_Parts:DMN3032LFDB-7: MOSFET MOSFET BVDSS Source: Datasheet <https://www.diodes.com/assets/Datasheets/DMN3032LFDB.pdf>; DESCRIPTION: MOSFET MOSFET BVDSS; HEIGHT: 0.605mm; MANUFACTURER_NAME: Diodes Incorporated; MANUFACTURER_PART_NUMBER: DMN3032LFDB-7; MOUSER_PART_NUMBER: 621-DMN3032LFDB-7; MOUSER_PRICE-STOCK: https://www.mouser.co.uk/ProductDetail/Diodes-Incorporated/DMN3032LFDB-7?qs=60RJRzIpcl%2FACqnWGZWGig%3D%3D
IC10 = SamacSys_Parts:BMM350: Board Mount Hall Effect / Magnetic Sensors High-Performance Magnometer Source: Datasheet <https://www.bosch-sensortec.com/media/boschsensortec/downloads/datasheets/bst-bmm350-ds001.pdf>; DESCRIPTION: Board Mount Hall Effect / Magnetic Sensors High-Performance Magnometer; HEIGHT: 0.54mm; MANUFACTURER_NAME: BOSCH; MANUFACTURER_PART_NUMBER: BMM350; MOUSER_PART_NUMBER: 262-BMM350; MOUSER_PRICE-STOCK: https://www.mouser.co.uk/ProductDetail/Bosch-Sensortec/BMM350?qs=amGC7iS6iy9v98dnmxozLQ%3D%3D
IC12 = BQ25180YBGR:BQ25180YBGR: Charger IC Lithium Ion/Polymer, Lithium Iron Phosphate 8-DSBGA (1.6x1.1) Source: Datasheet <https://www.ti.com/lit/ds/symlink/bq25180.pdf?ts=1650264094470&ref_url=https%3A%2F%2Fwww.ti.com%2Fproduct%2FBQ25180>; DESCRIPTION: Charger IC Lithium Ion/Polymer, Lithium Iron Phosphate 8-DSBGA (1.6x1.1); HEIGHT: 0.5mm; MANUFACTURER_NAME: Texas Instruments; MANUFACTURER_PART_NUMBER: BQ25180YBGR; MOUSER_PART_NUMBER: 595-BQ25180YBGR; MOUSER_PRICE-STOCK: https://www.mouser.co.uk/ProductDetail/Texas-Instruments/BQ25180YBGR?qs=doiCPypUmgEWjAK%252BJAX6Tw%3D%3D
IC13 = nRF52840-QIAA-T:NRF52840-QIAA-T: RF System on a Chip - SoC BLE ANT 2.4GHz SOC Source: Datasheet; DESCRIPTION: RF System on a Chip - SoC BLE ANT 2.4GHz SOC; HEIGHT: 0.85mm; MANUFACTURER_NAME: Nordic Semiconductor; MANUFACTURER_PART_NUMBER: nRF52840-QIAA-T; MOUSER_PART_NUMBER: 949-NRF52840-QIAA-T; MOUSER_PRICE-STOCK: https://www.mouser.co.uk/ProductDetail/Nordic-Semiconductor/nRF52840-QIAA-T?qs=AQlKX63v8RtTyx08F8csPQ%3D%3D
J1 J2 = USB4110-GF-A_REVB:USB4110-GF-A_REVB: Check availability <https://pricing.snapeda.com/parts/USB4110-GF-A/GCT/view-part?ref=eda>; AVAILABILITY: In Stock; DESCRIPTION: USB-C (USB TYPE-C) USB 2.0 Receptacle Connector 24 (16+8 Dummy) Position Surface Mount, Right Angle; Through Hole; MF: GCT; MP: USB4110-GF-A; PACKAGE: None; PRICE: None; PURCHASE-URL: https://pricing.snapeda.com/search/part/USB4110-GF-A/?ref=eda
JP1 JP8 JP9 = pinhead:PINHD-2X4: PIN HEADER
JP2-JP7 JP10-JP13 JP15 JP16 JP19-JP24 JP27-JP30 JP33-JP36 = SparkFun-Jumpers:JUMPER-SMT_2_NO: Normally open jumper This jumper has two pads in close proximity to each other. Apply solder to close the connection. Round pads are easier to solder for beginners, but are a lot larger. SparkFun Product that uses the round pads: SparkFun EL Sequencer <https://www.sparkfun.com/products/12781>
L1-L5 = rcl:L-US: INDUCTOR, American symbol; SPICEPREFIX: L
LED1-LED7 = led:LED: LED OSRAM: - CHIPLED LG R971, LG N971, LY N971, LG Q971, LY Q971, LO R971, LY R971 LH N974, LH R974 LS Q976, LO Q976, LY Q976 LO Q996 - Hyper CHIPLED LW Q18S LB Q993, LB Q99A, LB R99A - SideLED LS A670, LO A670, LY A670, LG A670, LP A670 LB A673, LV A673, LT A673, LW A673 LH A674 LY A675 LS A676, LA A676, LO A676, LY A676, LW A676 LS A679, LY A679, LG A679 - Hyper Micro SIDELED® LS Y876, LA Y876, LO Y876, LY Y876 LT Y87S - SmartLED LW L88C, LW L88S LB L89C, LB L89S, LG L890 LS L89K, LO L89K, LY L89K LS L896, LA L896, LO L896, LY L896 - TOPLED LS T670, LO T670, LY T670, LG T670, LP T670 LSG T670, LSP T670, LSY T670, LOP T670, LYG T670 LG T671, LOG T671, LSG T671 LB T673, LV T673, LT T673, LW T673 LH T674 LS T676, LA T676, LO T676, LY T676, LB T676, LH T676, LSB T676, LW T676 LB T67C, LV T67C, LT T67C, LS T67K, LO T67K, LY T67K, LW E67C LS E67B, LA E67B, LO E67B, LY E67B, LB E67C, LV E67C, LT E67C LW T67C LS T679, LY T679, LG T679 LS T770, LO T770, LY T770, LG T770, LP T770 LB T773, LV T773, LT T773, LW T773 LH T774 LS E675, LA E675, LY E675, LS T675 LS T776, LA T776, LO T776, LY T776, LB T776 LHGB T686 LT T68C, LB T68C - Hyper Mini TOPLED® LB M676 - Mini TOPLED Santana® LG M470 LS M47K, LO M47K, LY M47K Source: http://www.osram.convergy.de LUXEON: - LUMILED® LXK2-PW12-R00, LXK2-PW12-S00, LXK2-PW14-U00, LXK2-PW14-V00 LXK2-PM12-R00, LXK2-PM12-S00, LXK2-PM14-U00 LXK2-PE12-Q00, LXK2-PE12-R00, LXK2-PE12-S00, LXK2-PE14-T00, LXK2-PE14-U00 LXK2-PB12-K00, LXK2-PB12-L00, LXK2-PB12-M00, LXK2-PB14-N00, LXK2-PB14-P00, LXK2-PB14-Q00 LXK2-PR12-L00, LXK2-PR12-M00, LXK2-PR14-Q00, LXK2-PR14-R00 LXK2-PD12-Q00, LXK2-PD12-R00, LXK2-PD12-S00 LXK2-PH12-R00, LXK2-PH12-S00 LXK2-PL12-P00, LXK2-PL12-Q00, LXK2-PL12-R00 Source: www.luxeon.com KINGBRIGHT: KA-3528ASYC Source: www.kingbright.com
Q1-Q4 = SQ2308FES-T1_GE3:SQ2308FES-T1_GE3: TrenchFET Power MOSFET AEC-Q101 Qualified 100 % Rg and UIS Tested Material categorization: for definitions of compliance please see www.vishay.com/doc?99912 Source: Datasheet <https://www.vishay.com/docs/62166/sq2308fes.pdf>; DESCRIPTION: TrenchFET Power MOSFET AEC-Q101 Qualified 100 % Rg and UIS Tested Material categorization: for definitions of compliance please see www.vishay.com/doc?99912; HEIGHT: 1.12mm; MANUFACTURER_NAME: Vishay; MANUFACTURER_PART_NUMBER: SQ2308FES-T1_GE3; MOUSER_PART_NUMBER: 78-SQ2308FES-T1_GE3; MOUSER_PRICE-STOCK: https://www.mouser.co.uk/ProductDetail/Vishay-Siliconix/SQ2308FES-T1_GE3?qs=ZcfC38r4PoupuGjiHB5ucg%3D%3D
S1 = SparkFun-Switches:SWITCH-SPDT: Single Pole, Double Throw (SPDT) Switch Single-pole, double-throw (SPDT) switch. Variant Overview SMD-AYZ0202 Surface Mount DPDT Switch <https://www.sparkfun.com/products/597> (COM-00597) Used on e.g. LilyPad Arduino USB - ATmega32U4 Board <https://www.sparkfun.com/products/12049> PTH-11.6X4.0MM SPDT Mini Power Switch <https://www.sparkfun.com/products/102> (COM-00102) Used on e.g. SparkFun Simon Says - Through-Hole Soldering Kit <https://www.sparkfun.com/products/10547> (KIT-10547) PTH-11.6X4.0MM-KIT KIT version of SPDT Mini Power Switch - Simplifies soldering by removing tStop of switch pins - only one side can be soldered. PTH-11.6X4.0MM-LOCK LOCK version of SPDT Mini Power Switch - Offset pins hold switch in place for easier soldering. SMD-RIGHT-ANGLE Surface Mount Right Angle Switch <https://www.sparkfun.com/products/10860> (COM-10860) Used on e.g. SparkFun ESP8266 Thing <https://www.sparkfun.com/products/13231>; PROD_ID: SWCH-10651; SF_SKU: COM-10860
SW1 = microbuilder:SWITCH_TACT_SMT: SMT Tact Switches 6x6mm - Digikey: P12940SCT-ND KMR2 (4.6x2.8mm) - Digikey: 401-1426-1-ND EVQ-PQHB55 - Light Touch, 160GF (4.5x4.5mm) - Digikey: P8090SCT-ND KMT0 - KMT021 NGJ LHS (etc.) IP68/Waterproof - Digikey: CKN10289CT-ND
U1 = tinycircuits:AS-ITM-00473: INTEGRATED OPTICAL SENSOR; PARTNO: AS-ITM-00473
U2 = SamacSys_Parts:MLX90632SLD-DCB-100-RE: Temperature Sensor Digital, Infrared (IR) -20C ~ 85C 0.02C 5-SFN (3x3) Source: Datasheet <https://www.melexis.com/en/documents/documentation/datasheets/datasheet-mlx90632>; DESCRIPTION: Temperature Sensor Digital, Infrared (IR) -20C ~ 85C 0.02C 5-SFN (3x3); HEIGHT: 1mm; MANUFACTURER_NAME: Melexis; MANUFACTURER_PART_NUMBER: MLX90632SLD-DCB-100-RE; MOUSER_PART_NUMBER: 482-90632SLDDCB100RE; MOUSER_PRICE-STOCK: https://www.mouser.co.uk/ProductDetail/Melexis/MLX90632SLD-DCB-100-RE?qs=W%2FMpXkg%252BdQ5ec8j9SvRcaw%3D%3D
U3 = microbuilder:CP2104: CP2104 - USB to UART Bridge VDD Output: 3.45V
U5 = my_library:TPS7A0318PDQNR; COPYRIGHT: Copyright (C) 2025 Ultra Librarian. All rights reserved.; MANUFACTURER_PART_NUMBER: TPS7A0318PDQNR; MFR_NAME: Texas Instruments; REFDES: RefDes; TYPE: TYPE
U6 = my_library:TPS7A0333PDQNR; COPYRIGHT: Copyright (C) 2025 Ultra Librarian. All rights reserved.; MANUFACTURER_PART_NUMBER: TPS7A0333PDQNR; MFR_NAME: Texas Instruments; REFDES: RefDes; TYPE: TYPE
U$3 = my_library:GRP160722
U$6 = XTX XTSDG08GWSIGA:XTXXTSDG08GWSIGA
U$8 = my_library:CX-4MM-JZ
Y1 = 830065253:830065253: 1.6 x 1.0mm SMD crystal in a hermetically sealed ceramic package. Source: Datasheet <https://www.we-online.com/catalog/datasheet/830065253.pdf>; DESCRIPTION: 1.6 x 1.0mm SMD crystal in a hermetically sealed ceramic package.; HEIGHT: 0.5mm; MANUFACTURER_NAME: Wurth Elektronik; MANUFACTURER_PART_NUMBER: 830065253; MOUSER_PART_NUMBER: 710-830065253; MOUSER_PRICE-STOCK: https://www.mouser.co.uk/ProductDetail/Wurth-Elektronik/830065253?qs=2WXlatMagcE5o8krQdIeDA%3D%3D
Y4 = SamacSys_Parts:ECS-320-10-48B-CKY-TR: Crystals CRYSTAL 32.000MHZ ECX-1048B +/-10ppm +/-10ppm 10pF 150 Ohm Fundamental -30 C 85 C Surface Mount 4-SMD, No Lead W 1.20mm x 1.00mm) (0.33mm) Source: Datasheet; DESCRIPTION: Crystals CRYSTAL 32.000MHZ ECX-1048B +/-10ppm +/-10ppm 10pF 150 Ohm Fundamental -30 C 85 C Surface Mount 4-SMD, No Lead W 1.20mm x 1.00mm) (0.33mm); HEIGHT: 0.33mm; MANUFACTURER_NAME: ECS; MANUFACTURER_PART_NUMBER: ECS-320-10-48B-CKY-TR; MOUSER_PART_NUMBER: 520-S3201048BCKYTR; MOUSER_PRICE-STOCK: https://www.mouser.co.uk/ProductDetail/ECS/ECS-320-10-48B-CKY-TR?qs=zW32dvEIR3umcnJFx9fznA%3D%3D

## Net classes
1 POWER: width 0.127 mm